# EAGLE design tree-r1 (EAGLE 5.12)
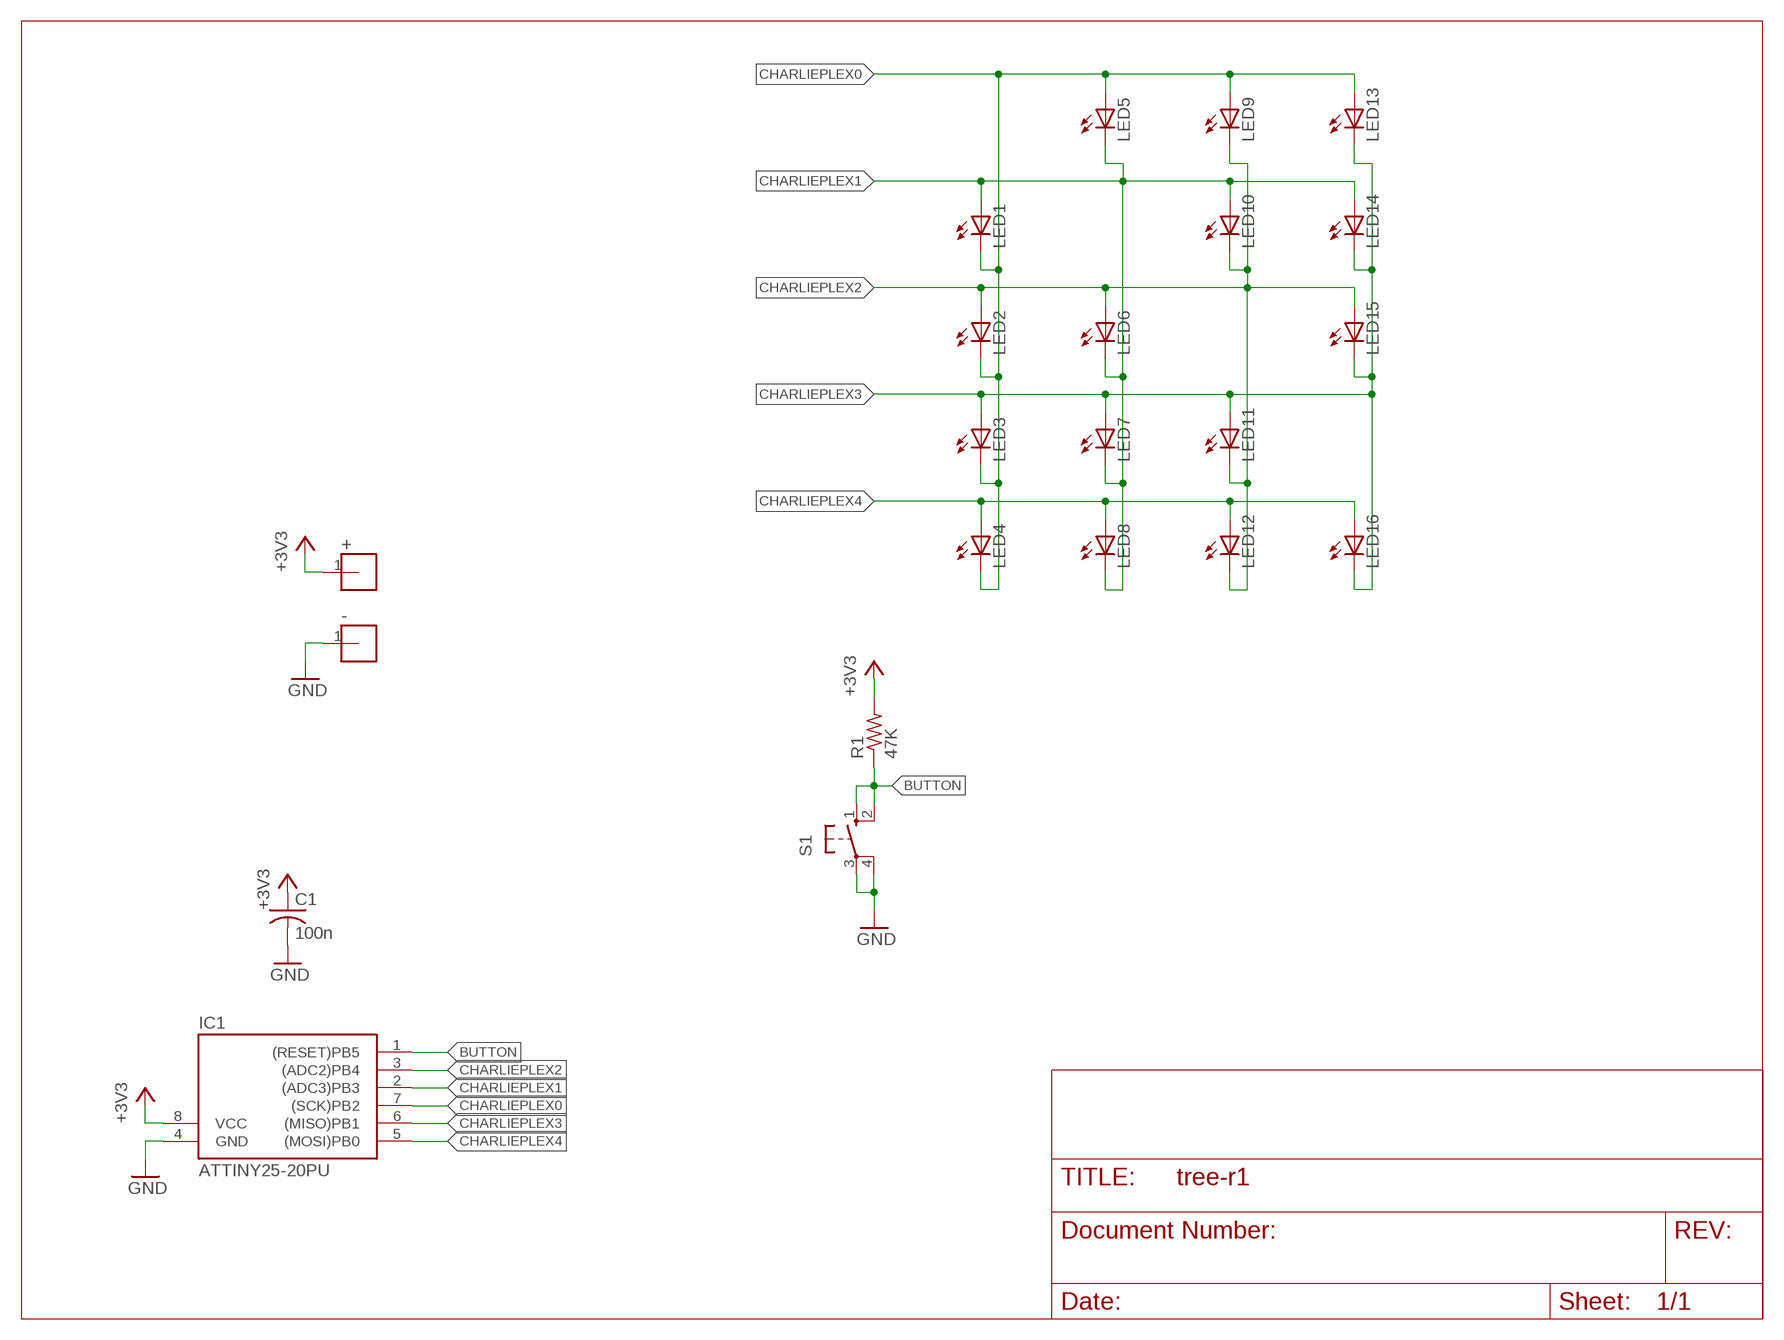
[diagram p0: schematic, sheet 1]

## Parts
+  M01-100MIL  [100MIL-1]
-  M01-100MIL  [100MIL-1]
C1  100n  C-US050-025X075  [C050-025X075]
IC1  ATTINY25-20PU  TINY138P3  [DIL08]
LED1  LED3MM  [LED3MM]
LED2  LED3MM  [LED3MM]
LED3  LED3MM  [LED3MM]
LED4  LED3MM  [LED3MM]
LED5  LED3MM  [LED3MM]
LED6  LED3MM  [LED3MM]
LED7  LED3MM  [LED3MM]
LED8  LED3MM  [LED3MM]
LED9  LED3MM  [LED3MM]
LED10  LED3MM  [LED3MM]
LED11  LED3MM  [LED3MM]
LED12  LED3MM  [LED3MM]
LED13  LED3MM  [LED3MM]
LED14  LED3MM  [LED3MM]
LED15  LED3MM  [LED3MM]
LED16  LED3MM  [LED3MM]
R1  47K  R-US_0207/10  [0207/10]
S1  10-XX  [B3F-10XX]

## Nets
+3V3: +.1 C1.1 IC1.8(VCC) R1.2
BUTTON: IC1.1((RESET)PB5) R1.1 S1.1(S) S1.2(S1)
CHARLIEPLEX0: IC1.7((SCK)PB2) LED1.K(C) LED2.K(C) LED3.K(C) LED4.K(C) LED5.A LED9.A LED13.A
CHARLIEPLEX1: IC1.2((ADC3)PB3) LED1.A LED5.K(C) LED6.K(C) LED7.K(C) LED8.K(C) LED10.A LED14.A
CHARLIEPLEX2: IC1.3((ADC2)PB4) LED2.A LED6.A LED9.K(C) LED10.K(C) LED11.K(C) LED12.K(C) LED15.A
CHARLIEPLEX3: IC1.6((MISO)PB1) LED3.A LED7.A LED11.A LED13.K(C) LED14.K(C) LED15.K(C) LED16.K(C)
CHARLIEPLEX4: IC1.5((MOSI)PB0) LED4.A LED8.A LED12.A LED16.A
GND: -.1 C1.2 IC1.4(GND) S1.3(P) S1.4(P1)

## Library data of the parts
+ - = rbg-generic-headers:M01-100MIL
C1 = rcl:C-US: CAPACITOR, American symbol
IC1 = avr-5:TINY13*
LED1-LED16 = led:LED: LED OSRAM: - CHIPLED LG R971, LG N971, LY N971, LG Q971, LY Q971, LO R971, LY R971 LH N974, LH R974 LS Q976, LO Q976, LY Q976 LO Q996 - Hyper CHIPLED LW Q18S LB Q993, LB Q99A, LB R99A - SideLED LS A670, LO A670, LY A670, LG A670, LP A670 LB A673, LV A673, LT A673, LW A673 LH A674 LY A675 LS A676, LA A676, LO A676, LY A676, LW A676 LS A679, LY A679, LG A679 - Hyper Micro SIDELED® LS Y876, LA Y876, LO Y876, LY Y876 LT Y87S - SmartLED LW L88C, LW L88S LB L89C, LB L89S, LG L890 LS L89K, LO L89K, LY L89K LS L896, LA L896, LO L896, LY L896 - TOPLED LS T670, LO T670, LY T670, LG T670, LP T670 LSG T670, LSP T670, LSY T670, LOP T670, LYG T670 LG T671, LOG T671, LSG T671 LB T673, LV T673, LT T673, LW T673 LH T674 LS T676, LA T676, LO T676, LY T676, LB T676, LH T676, LSB T676, LW T676 LB T67C, LV T67C, LT T67C, LS T67K, LO T67K, LY T67K, LW E67C LS E67B, LA E67B, LO E67B, LY E67B, LB E67C, LV E67C, LT E67C LW T67C LS T679, LY T679, LG T679 LS T770, LO T770, LY T770, LG T770, LP T770 LB T773, LV T773, LT T773, LW T773 LH T774 LS E675, LA E675, LY E675, LS T675 LS T776, LA T776, LO T776, LY T776, LB T776 LHGB T686 LT T68C, LB T68C - Hyper Mini TOPLED® LB M676 - Mini TOPLED Santana® LG M470 LS M47K, LO M47K, LY M47K Source: http://www.osram.convergy.de LUXEON: - LUMILED® LXK2-PW12-R00, LXK2-PW12-S00, LXK2-PW14-U00, LXK2-PW14-V00 LXK2-PM12-R00, LXK2-PM12-S00, LXK2-PM14-U00 LXK2-PE12-Q00, LXK2-PE12-R00, LXK2-PE12-S00, LXK2-PE14-T00, LXK2-PE14-U00 LXK2-PB12-K00, LXK2-PB12-L00, LXK2-PB12-M00, LXK2-PB14-N00, LXK2-PB14-P00, LXK2-PB14-Q00 LXK2-PR12-L00, LXK2-PR12-M00, LXK2-PR14-Q00, LXK2-PR14-R00 LXK2-PD12-Q00, LXK2-PD12-R00, LXK2-PD12-S00 LXK2-PH12-R00, LXK2-PH12-S00 LXK2-PL12-P00, LXK2-PL12-Q00, LXK2-PL12-R00 Source: www.luxeon.com KINGBRIGHT: KA-3528ASYC Source: www.kingbright.com
R1 = rcl:R-US_: RESISTOR, American symbol
S1 = rbg-generic-tact-switch:10-XX: OMRON SWITCH

## Board
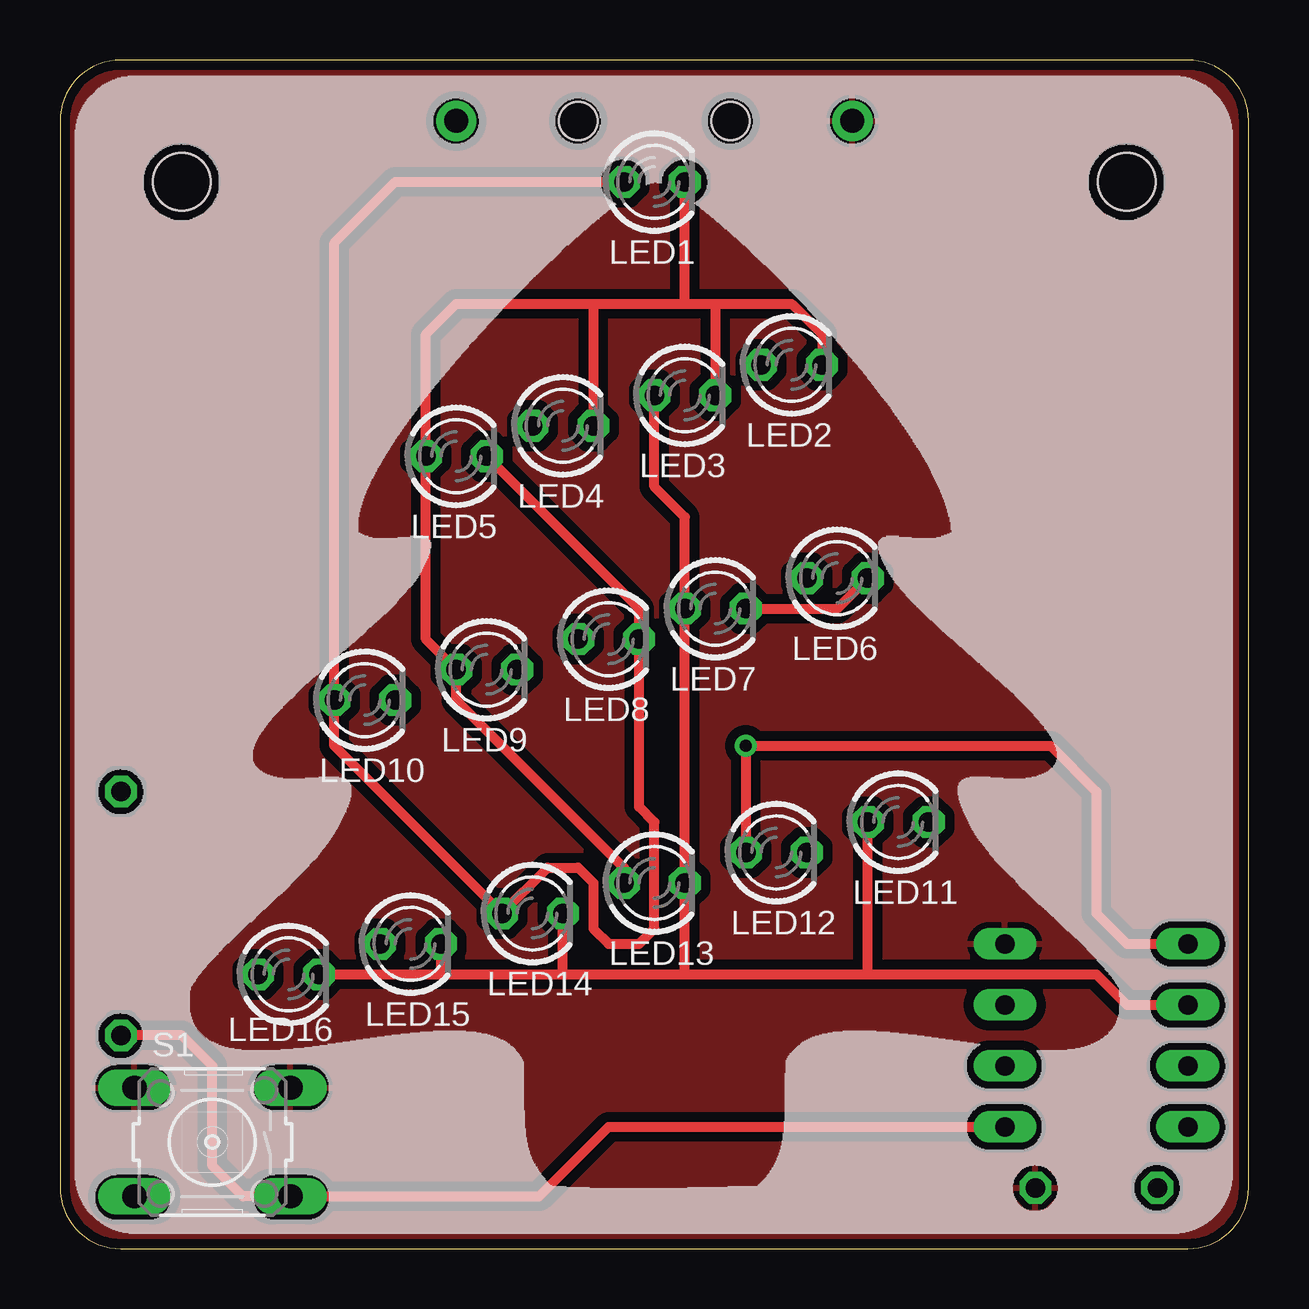
[diagram p1: board, top side]
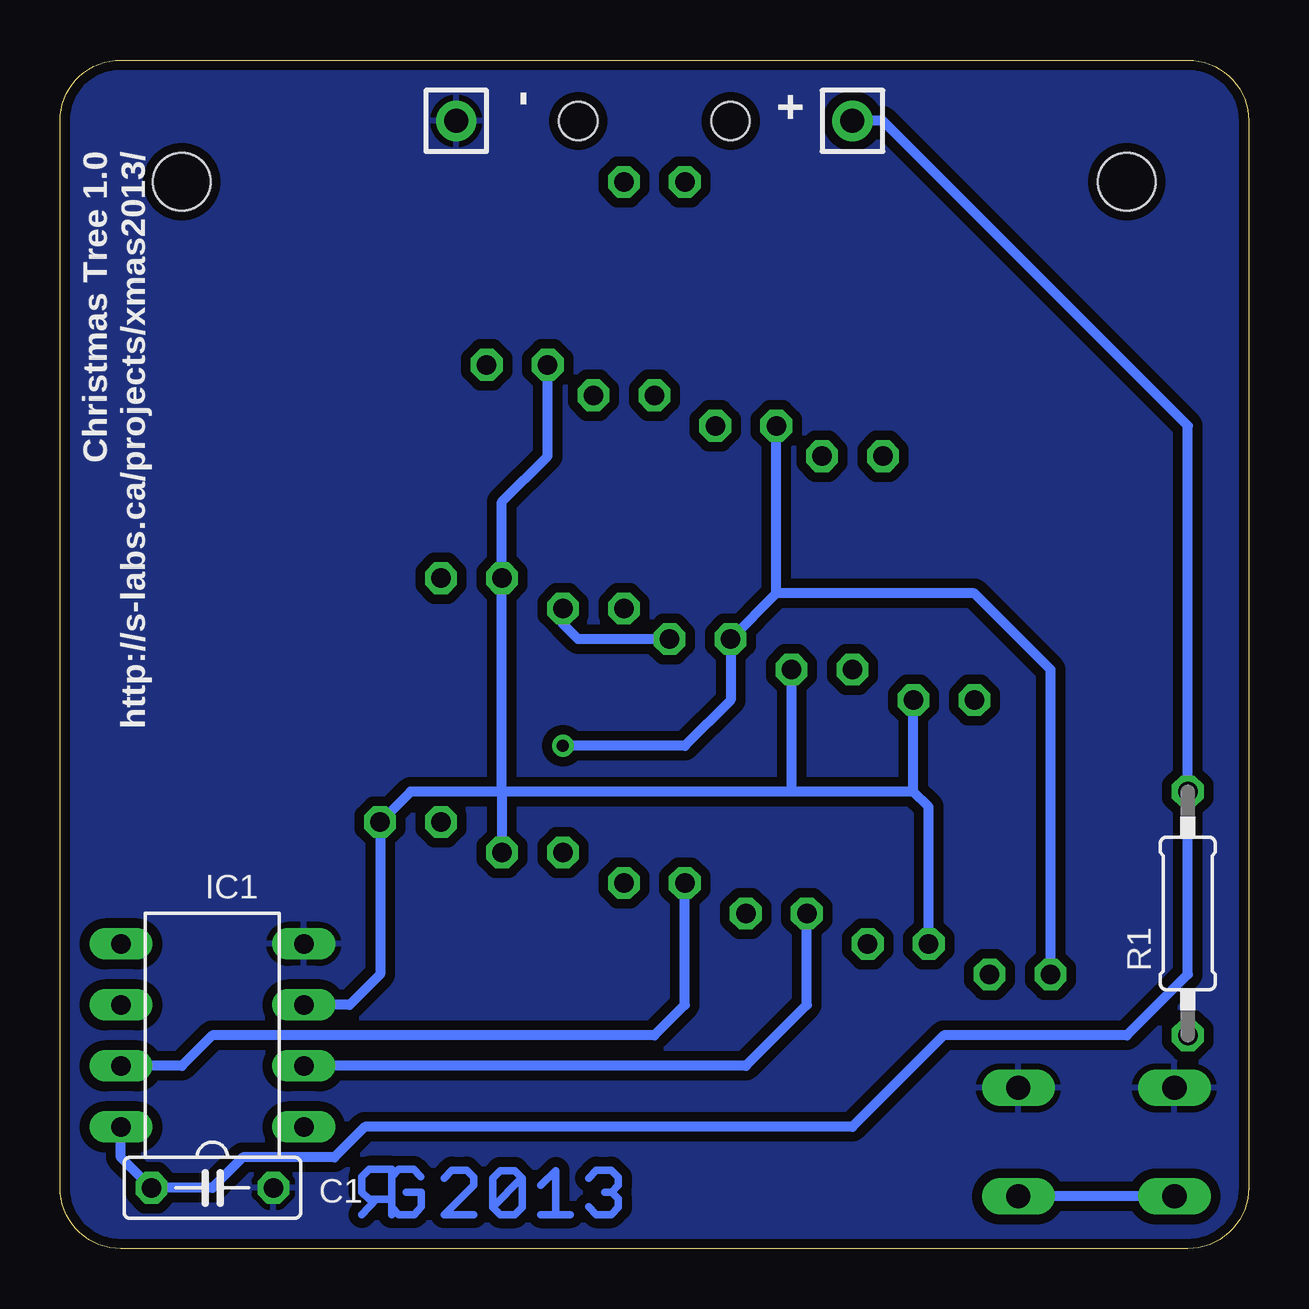
[diagram p2: board, bottom side, seen from below]

Size 49.53 x 49.53 mm. Coordinates in mm from the lower left corner, seen from the top.
Outline: 46.99,0 arc90 49.53,2.54 49.53,46.99 arc90 46.99,49.53 2.54,49.53 arc90 0,46.99 0,2.54 arc90 2.54,0 46.99,0
Copper layers (1*16): Top 0.035mm / dielectric 1.5mm / Bottom 0.035mm
Design rules "default *": minimum track width 10mil, minimum drill 0.5mm, track to track 8mil, track to pad 8mil, pad to pad 8mil, via to via 8mil, smd to smd 8mil, copper to edge 10mil, drill to drill 8mil, minimum pad ring 10mil, minimum via ring 8mil, stop-mask expansion 4mil, vias tented up to drill 20mil, thermal gap 10mil
Holes 2.4 mm at 5.08,44.45 44.45,44.45
Holes 1.6 mm at 21.59,46.99 27.94,46.99

### Footprints (pad centres in the part's own frame; a part is rotated, then mirrored left to right if it is on the bottom)
100MIL-1 = drill 1 pad 1.676 round: 1 0,0
C050-025X075 = drill 0.813 octagon: 1 -2.54,0; 2 2.54,0
DIL08 = drill 0.813 long: 1 -3.81,-3.81; 2 -1.27,-3.81; 3 1.27,-3.81; 4 3.81,-3.81; 5 3.81,3.81; 6 1.27,3.81; 7 -1.27,3.81; 8 -3.81,3.81
LED3MM = drill 0.813 octagon: A -1.27,0; K 1.27,0
0207/10 = drill 0.813 octagon: 1 -5.08,0; 2 5.08,0
B3F-10XX = drill 1.016 long: 1 -3.251,2.261; 2 3.251,2.261; 3 -3.251,-2.261; 4 3.251,-2.261

### Placement (x,y rotation side)
+  16.51,46.99 90 bottom
-  33.02,46.99 270 bottom
C1  43.18,2.54 0 bottom
IC1  43.18,8.89 90 bottom
LED1  24.77,44.45 0 top
LED2  30.48,36.83 0 top
LED3  26.04,35.56 0 top
LED4  20.95,34.29 0 top
LED5  16.51,33.02 0 top
LED6  32.38,27.94 0 top
LED7  27.3,26.67 0 top
LED8  22.86,25.4 0 top
LED9  17.78,24.13 0 top
LED10  12.7,22.86 0 top
LED11  34.92,17.78 0 top
LED12  29.84,16.51 0 top
LED13  24.77,15.24 0 top
LED14  19.68,13.97 0 top
LED15  14.61,12.7 0 top
LED16  9.53,11.43 0 top
R1  2.54,13.97 90 bottom
S1  6.35,4.45 180 top
U$1  [TREE]  0.64,0.64 0 top
U$2  [RGLOGO_SMALL_2013]  35.56,1.27 0 bottom

### Tracks (layer width: path | path; a pad name or v marks a point on that pad's centre or on a via)
+3V3
  Bottom 0.406: IC1.8 46.99,3.81 C1.1 43.18,2.54 41.91,3.81 38.1,3.81 36.83,5.08 16.51,5.08 12.7,8.89 5.08,8.89 2.54,11.43 R1.2 2.54,34.29 15.24,46.99 +.1
BUTTON
  Top 0.406: R1.1 5.08,8.89 6.35,7.62 6.35,3.45 7.62,2.18 S1.1 19.96,2.18 22.86,5.08 IC1.1
  Bottom 0.406: S1.2 S1.1
CHARLIEPLEX0
  Top 0.406: LED2.K 31.75,38.1 30.48,39.37 27.3,39.37 | 22.23,39.37 16.51,39.37 15.24,38.1 LED5.A 15.24,25.4 LED9.A 16.51,22.86 23.5,15.88 LED13.A | 22.23,39.37 26.04,39.37 | 26.04,39.37 27.3,39.37 | 22.23,39.37 LED4.K | 26.04,39.37 LED1.K | 27.3,39.37 LED3.K
  Bottom 0.406: LED13.A 23.5,10.16 24.77,8.89 43.18,8.89 44.45,7.62 IC1.7
CHARLIEPLEX1
  Top 0.406: LED1.A 13.97,44.45 11.43,41.91 LED10.A 11.43,20.95 LED14.A 20.32,15.88 21.59,15.88 22.23,15.24 22.23,13.34 22.86,12.7 24.13,12.7 24.77,13.34 24.77,17.78 24.13,18.41 LED8.K 24.13,26.67 LED5.K | LED7.K 32.38,26.67 LED6.K
  Bottom 0.406: LED7.K 28.57,26.04 27.94,25.4 LED8.K | IC1.2 20.95,7.62 18.41,10.16 LED14.A
CHARLIEPLEX2
  Bottom 0.406: LED15.A 13.34,18.41 13.97,19.05 | 13.97,19.05 19.05,19.05 | 19.05,19.05 31.11,19.05 | 31.11,19.05 34.92,19.05 LED11.K 36.2,11.43 37.47,10.16 IC1.3 | 31.11,19.05 LED12.K | 13.97,19.05 LED10.K | 19.05,19.05 LED9.K | LED2.A 29.21,33.02 31.11,31.11 LED6.A 31.11,19.05
CHARLIEPLEX3
  Top 0.406: LED16.K 15.88,11.43 | 15.88,11.43 20.95,11.43 | 20.95,11.43 26.04,11.43 | 26.04,11.43 33.66,11.43 | 33.66,11.43 LED11.A | 26.04,11.43 LED13.K LED7.A 26.04,30.48 24.77,31.75 LED3.A | 20.95,11.43 LED14.K | 15.88,11.43 LED15.K | IC1.6 44.45,10.16 43.18,11.43 33.66,11.43
CHARLIEPLEX4  (via drill 0.5)
  Top 0.406: IC1.5 44.45,12.7 43.18,13.97 43.18,19.05 41.27,20.95 v28.57,20.95 LED12.A
  Bottom 0.406: 19.68,27.3 LED4.A | 19.68,27.3 LED8.A 21.59,22.86 23.5,20.95 v28.57,20.95 | LED16.A 8.26,24.13 11.43,27.3 19.68,27.3
GND
  pour Top (isolate 0.406): -1.27,50.8 50.8,50.8 50.8,-1.27 -1.27,-1.27
  pour Bottom (isolate 0.406): -1.27,50.8 50.8,50.8 50.8,-1.27 -1.27,-1.27

### Text on the board
bPlace: http://s-labs.ca/projects/xmas2013/ | Christmas Tree 1.0